# Altium schematic sheet Test.SchDoc
size A4
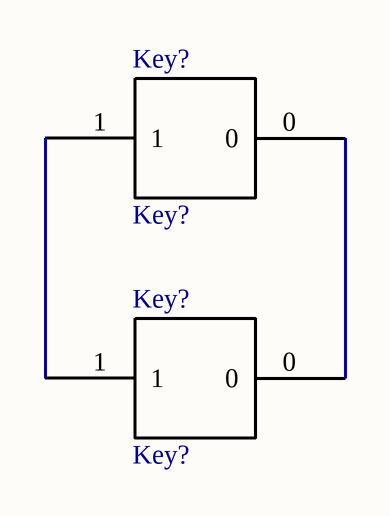
[diagram p0: Test.SchDoc]

## Parts
(Parts that share a designator on the sheet are numbered #1, #2 ... from top to bottom, then left to right.)
Key?#1  Key?  [Cherry Standard MX Switch]
Key?#2  Key?  [Cherry Standard MX Switch]

## Nets
NetKey?#1_0: Key?#1.0 Key?#2.0
NetKey?#1_1: Key?#1.1 Key?#2.1

## Library data of the parts
Key?#1 Key?#2 = Cherry MX